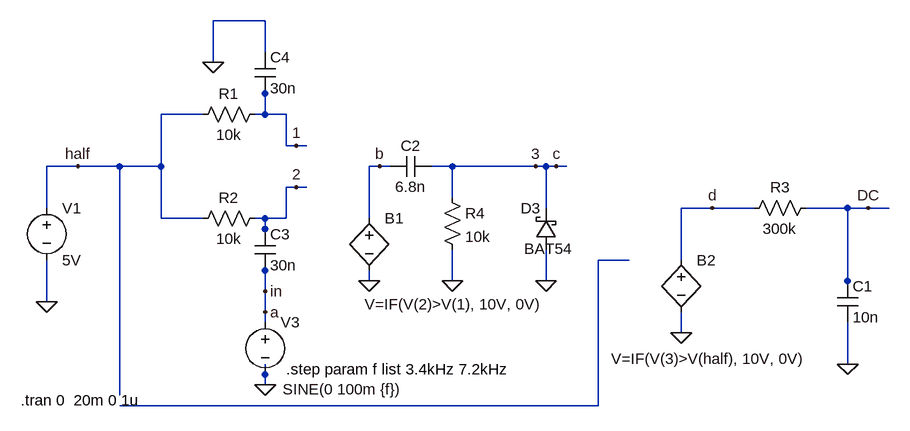
[diagram p0: schematic Miguel Villa Floran - EE 245 Final.asc]
Miguel Villa Floran - EE 245 Final.asc, the LTspice schematic file:
Version 4
SHEET 1 1652 680
WIRE 544 -336 464 -336
WIRE 544 -288 544 -336
WIRE 464 -272 464 -336
WIRE 544 -224 544 -240
WIRE 448 -192 384 -192
WIRE 544 -192 544 -224
WIRE 544 -192 528 -192
WIRE 576 -192 544 -192
WIRE 576 -144 576 -192
WIRE 592 -144 576 -144
WIRE 608 -144 592 -144
WIRE 256 -112 208 -112
WIRE 320 -112 256 -112
WIRE 384 -112 384 -192
WIRE 384 -112 320 -112
WIRE 720 -112 704 -112
WIRE 736 -112 720 -112
WIRE 832 -112 800 -112
WIRE 960 -112 832 -112
WIRE 976 -112 960 -112
WIRE 992 -112 976 -112
WIRE 1008 -112 992 -112
WIRE 592 -80 576 -80
WIRE 608 -80 592 -80
WIRE 832 -64 832 -112
WIRE 208 -48 208 -112
WIRE 976 -48 976 -112
WIRE 1232 -48 1184 -48
WIRE 1296 -48 1232 -48
WIRE 1440 -48 1376 -48
WIRE 1472 -48 1440 -48
WIRE 1504 -48 1472 -48
WIRE 384 -32 384 -112
WIRE 448 -32 384 -32
WIRE 544 -32 528 -32
WIRE 576 -32 576 -80
WIRE 576 -32 544 -32
WIRE 704 -32 704 -112
WIRE 544 -16 544 -32
WIRE 544 0 544 -16
WIRE 1104 32 1056 32
WIRE 1184 32 1184 -48
WIRE 544 48 544 32
WIRE 704 64 704 48
WIRE 832 64 832 16
WIRE 976 64 976 16
WIRE 1440 64 1440 -48
WIRE 544 80 544 48
WIRE 1440 80 1440 64
WIRE 208 96 208 32
WIRE 544 112 544 80
WIRE 544 128 544 112
WIRE 1184 144 1184 112
WIRE 1440 192 1440 128
WIRE 544 208 544 192
WIRE 544 224 544 208
WIRE 320 240 320 -112
WIRE 1056 256 1056 32
WIRE 1056 256 320 256
FLAG 1184 144 0
FLAG 1440 192 0
FLAG 1472 -48 DC
FLAG 256 -112 half
FLAG 208 96 0
FLAG 592 -144 1
FLAG 592 -80 2
FLAG 464 -272 0
FLAG 544 224 0
FLAG 544 112 a
FLAG 704 64 0
FLAG 832 64 0
FLAG 976 64 0
FLAG 720 -112 b
FLAG 1232 -48 d
FLAG 544 80 in
FLAG 960 -112 3
FLAG 992 -112 c
SYMBOL voltage 208 -64 R0
SYMATTR InstName V1
SYMATTR Value 5V
SYMBOL res 1392 -64 R90
WINDOW 0 0 56 VBottom 2
WINDOW 3 32 56 VTop 2
SYMATTR InstName R3
SYMATTR Value 300k
SYMBOL cap 1424 64 R0
SYMATTR InstName C1
SYMATTR Value 10n
SYMBOL cap 528 -288 R0
SYMATTR InstName C4
SYMATTR Value 30n
SYMBOL res 544 -208 R90
WINDOW 0 0 56 VBottom 2
WINDOW 3 32 56 VTop 2
SYMATTR InstName R1
SYMATTR Value 10k
SYMBOL res 544 -48 R90
WINDOW 0 0 56 VBottom 2
WINDOW 3 32 56 VTop 2
SYMATTR InstName R2
SYMATTR Value 10k
SYMBOL cap 528 -16 R0
SYMATTR InstName C3
SYMATTR Value 30n
SYMBOL voltage 544 112 R0
WINDOW 3 27 119 Left 2
SYMATTR InstName V3
SYMATTR Value SINE(0 100m {f})
SYMBOL cap 800 -128 R90
WINDOW 0 0 32 VBottom 2
WINDOW 3 32 32 VTop 2
SYMATTR InstName C2
SYMATTR Value 6.8n
SYMBOL res 816 -80 R0
SYMATTR InstName R4
SYMATTR Value 10k
SYMBOL bv 704 -48 R0
WINDOW 3 -7 148 Left 2
SYMATTR Value V=IF(V(2)>V(1), 10V, 0V)
SYMATTR InstName B1
SYMBOL bv 1184 16 R0
WINDOW 3 -108 168 Left 2
SYMATTR Value V=IF(V(3)>V(half), 10V, 0V)
SYMATTR InstName B2
SYMBOL schottky 992 16 R180
WINDOW 0 24 64 Left 2
WINDOW 3 -24 1 Left 2
SYMATTR InstName D3
SYMATTR Value BAT54
TEXT 576 200 Left 2 !.step param f list 3.4kHz 7.2kHz
TEXT 168 248 Left 2 !.tran 0  20m 0 1u

The netlist it stands for:
* Miguel Villa Floran - EE 245 Final.asc
V1 half 0 5V
R3 DC d 300k
C1 DC 0 10n
C4 0 1 30n
R1 1 half 10k
R2 2 half 10k
C3 2 in 30n
V3 in 0 SINE(0 100m {f})
C2 c b 6.8n
R4 c 0 10k
B1 b 0 V=IF(V(2)>V(1), 10V, 0V)
B2 d 0 V=IF(V(3)>V(half), 10V, 0V)
D3 0 c BAT54
.model D D
.lib standard.dio
.step param f list 3.4kHz 7.2kHz
.tran 0  20m 0 1u
.backanno
.end